# EAGLE design StairLights (EAGLE 9.4.2)
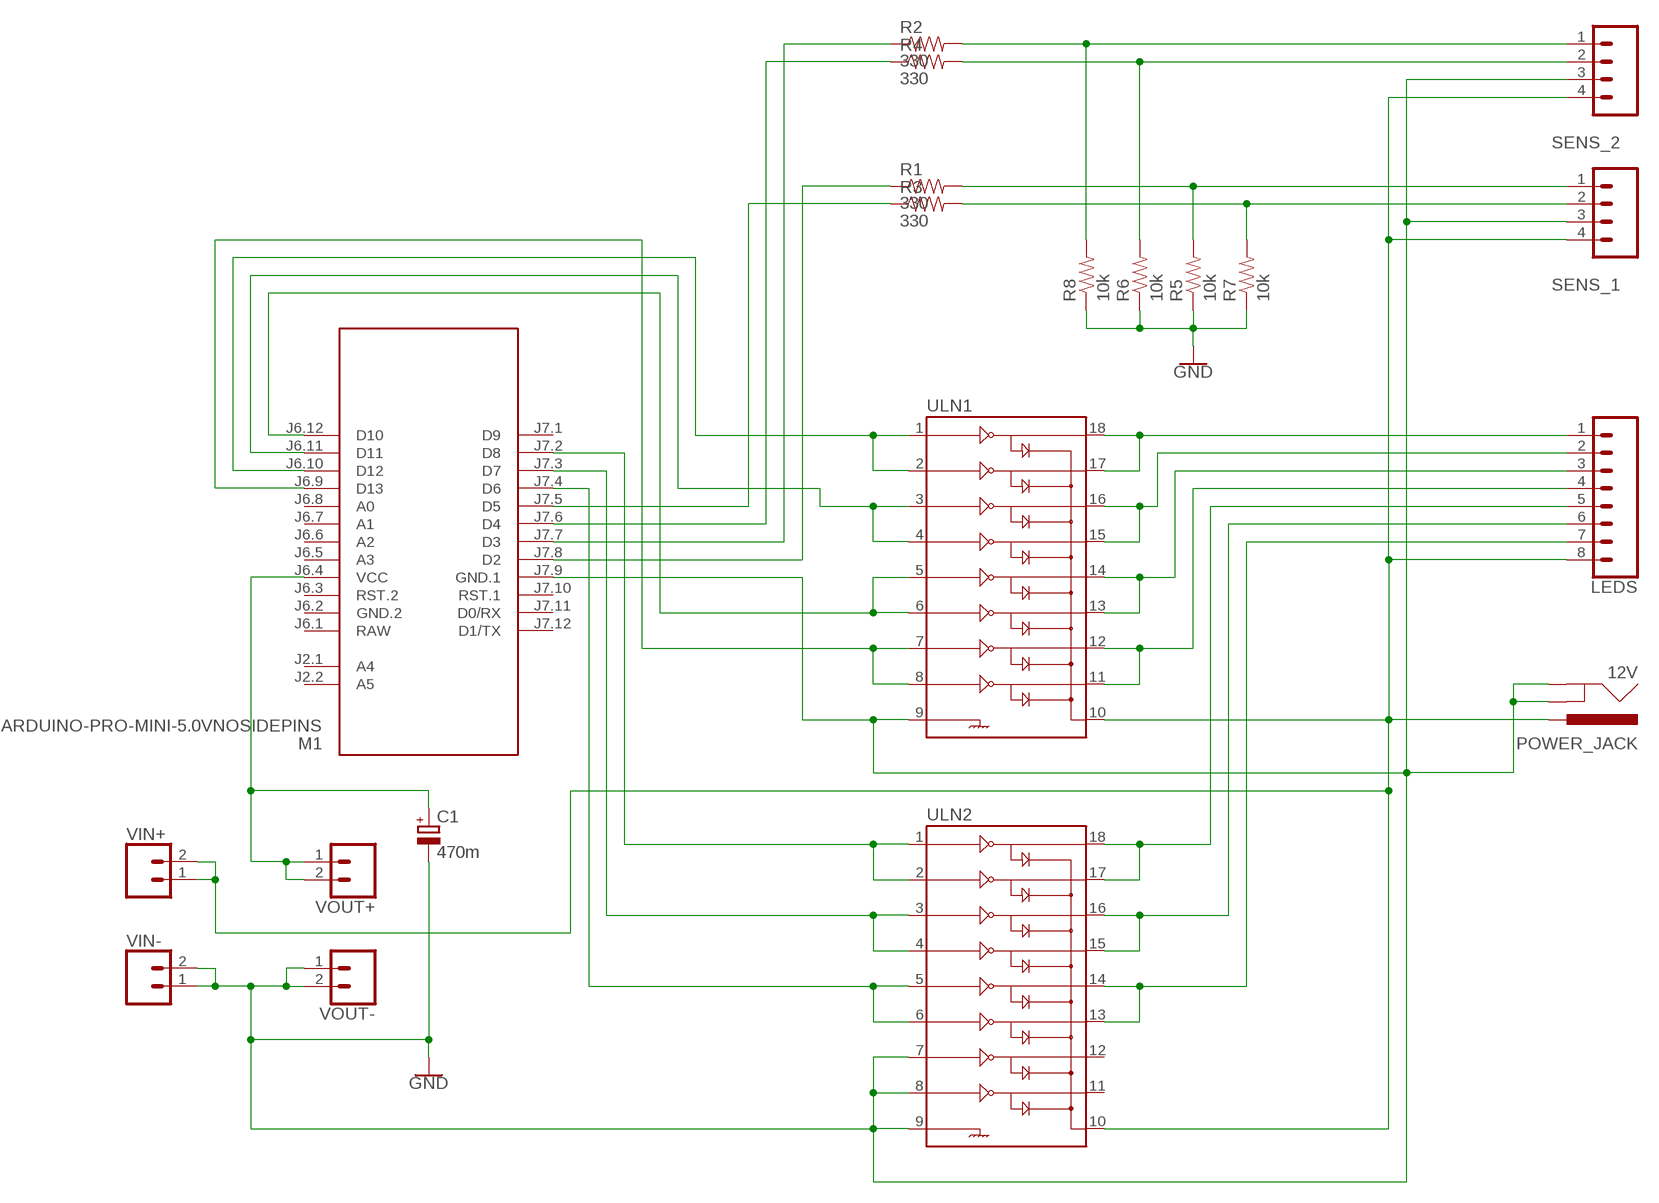
[diagram p0: schematic, sheet 1]

## Parts
12V  POWER_JACK  [POWER_JACK_PTH]
C1  470m  CPOL-EUE5-5  [E5-5]
LEDS  CONN_08LONGPADS  [1X08_LONGPADS]
M1  ARDUINO-PRO-MINI-5.0VNOSIDEPINS  [ARDUINO-PRO-MINI]
R1  330  330OHM-HORIZ-1/10W-5%  [AXIAL-0.3]
R2  330  330OHM-HORIZ-1/10W-5%  [AXIAL-0.3]
R3  330  330OHM-HORIZ-1/10W-5%  [AXIAL-0.3]
R4  330  330OHM-HORIZ-1/10W-5%  [AXIAL-0.3]
R5  10k  330OHM-HORIZ-1/10W-5%  [AXIAL-0.3]
R6  10k  330OHM-HORIZ-1/10W-5%  [AXIAL-0.3]
R7  10k  330OHM-HORIZ-1/10W-5%  [AXIAL-0.3]
R8  10k  330OHM-HORIZ-1/10W-5%  [AXIAL-0.3]
SENS_1  CONN_04LONGPADS  [1X04_LONGPADS]
SENS_2  CONN_04LONGPADS  [1X04_LONGPADS]
ULN1  ULN2803DIP  [DIL18]
ULN2  ULN2803DIP  [DIL18]
VIN+  CONN_02  [1X02]
VIN-  CONN_02  [1X02]
VOUT+  CONN_02  [1X02]
VOUT-  CONN_02  [1X02]

## Nets
GND: 12V.GND 12V.GNDBREAK C1.- M1.J7.9(GND.1) R5.P$1 R6.P$1 R7.P$1 R8.P$1 SENS_1.3 SENS_2.3 ULN1.9 ULN2.7 ULN2.8 ULN2.9 VIN-.1 VIN-.2 VOUT-.1 VOUT-.2
N$1: LEDS.1 ULN1.17 ULN1.18
N$2: LEDS.2 ULN1.15 ULN1.16
N$3: R2.P$2 R8.P$2 SENS_2.1
N$4: LEDS.3 ULN1.13 ULN1.14
N$5: M1.J6.12(D10) ULN1.5 ULN1.6
N$6: LEDS.4 ULN1.11 ULN1.12
N$7: R4.P$2 R6.P$2 SENS_2.2
N$8: LEDS.5 ULN2.17 ULN2.18
N$9: LEDS.6 ULN2.15 ULN2.16
N$10: M1.J6.10(D12) ULN1.1 ULN1.2
N$11: LEDS.7 ULN2.13 ULN2.14
N$12: M1.J7.8(D2) R1.P$1
N$13: M1.J7.3(D7) ULN2.3 ULN2.4
N$14: M1.J7.4(D6) ULN2.5 ULN2.6
N$15: R1.P$2 R5.P$2 SENS_1.1
N$16: 12V.PWR LEDS.8 SENS_1.4 SENS_2.4 ULN1.10 ULN2.10 VIN+.1 VIN+.2
N$17: C1.+ M1.J6.4(VCC) VOUT+.1 VOUT+.2
N$18: M1.J7.7(D3) R2.P$1
N$19: M1.J7.2(D8) ULN2.1 ULN2.2
N$20: M1.J7.6(D4) R4.P$1
N$21: R3.P$2 R7.P$2 SENS_1.2
N$22: M1.J7.5(D5) R3.P$1
N$26: M1.J6.9(D13) ULN1.7 ULN1.8
N$29: M1.J6.11(D11) ULN1.3 ULN1.4
Unconnected: M1.J2.1(A4) M1.J2.2(A5) M1.J6.3(RST.2) M1.J6.5(A3) M1.J6.6(A2) M1.J6.7(A1) M1.J6.8(A0) M1.J7.1(D9) M1.J7.10(RST.1) M1.J7.11(D0/RX) M1.J7.12(D1/TX) ULN2.11 ULN2.12

## Power pins joined to a net without a drawn wire
GND.2: M1.J6.2(GND.2)
RAW: M1.J6.1(RAW)

## Library data of the parts
12V = SparkFun-Connectors:POWER_JACK: Power Jack Connector This is the standard 5.5mm barrel jack for power. The PTH is the most common, proven, reliable, footprint. The Slot footprint only works if the mill layer is transmitted to the PCB fab house so be warned. Here are the connectors we sell at SparkFun: DC Barrel Power Jack/Connector <https://www.sparkfun.com/products/119> (PRT-00119) DC Barrel Power Jack/Connector (SMD) <https://www.sparkfun.com/products/12748> (PRT-12748) DC Barrel Jack Adapter - Breadboard Compatible <https://www.sparkfun.com/products/10811> (PRT-10811) It is used on this SparkFun product (and many, many others): SparkFun RedBoard - Programmed with Arduino <https://www.sparkfun.com/products/12757> (DEV-12757) Also, if you need a mating power supply or connector, please check these out: Wall Adapter Power Supply - 9VDC 650mA <https://www.sparkfun.com/products/298> (TOL-00298) DC Barrel Jack Adapter - Male <https://www.sparkfun.com/products/10287> (PRT-10287); PROD_ID: CONN-08197
C1 = resistor:CPOL-EU: POLARIZED CAPACITOR, European symbol
LEDS = SparkFun-Connectors:CONN_08: Multi connection point. Often used as Generic Header-pin footprint for 0.1 inch spaced/style header connections On any of the 0.1 inch spaced packages, you can populate with these: Break Away Headers - Straight <https://www.sparkfun.com/products/116> (PRT-00116) Break Away Male Headers - Right Angle <https://www.sparkfun.com/products/553> (PRT-00553) Female Headers <https://www.sparkfun.com/products/115> (PRT-00115) Break Away Headers - Machine Pin <https://www.sparkfun.com/products/117> (PRT-00117) Break Away Female Headers - Swiss Machine Pin <https://www.sparkfun.com/products/743> (PRT-00743) Arduino Stackable Header - 8 Pin <https://www.sparkfun.com/products/9279> (PRT-09279) For SCREWTERMINALS and SPRING TERMINALS visit here: Screw Terimnals on SparkFun.com <https://www.sparkfun.com/search/results?term=Screw+Terminals> (5mm/3.5mm/2.54mm spacing) This device is also useful as a general connection point to wire up your design to another part of your project. Our various solder wires solder well into these plated through hole pads. Hook-Up Wire - Assortment (Stranded, 22 AWG) <https://www.sparkfun.com/products/11375> (PRT-11375) Hook-Up Wire - Assortment (Solid Core, 22 AWG) <https://www.sparkfun.com/products/11367> (PRT-11367) View the entire wire category on our website here <https://www.sparkfun.com/categories/141> Special notes: Molex polarized connector foot print use with SKU : PRT-08231 with associated crimp pins and housings. 1MM SMD Version SKU: PRT-10208 NOTES ON THE VARIANTS LOCK and LOCK_LONGPADS... This footprint was designed to help hold the alignment of a through-hole component (i.e. 6-pin header) while soldering it into place. You may notice that each hole has been shifted either up or down by 0.005 of an inch from it's more standard position (which is a perfectly straight line). This slight alteration caused the pins (the squares in the middle) to touch the edges of the holes. Because they are alternating, it causes a "brace" to hold the component in place. 0.005 has proven to be the perfect amount of "off-center" position when using our standard breakaway headers. Although looks a little odd when you look at the bare footprint, once you have a header in there, the alteration is very hard to notice. Also,if you push a header all the way into place, it is covered up entirely on the bottom side.
M1 = diy-modules:ARDUINO-PRO-MINI-*: Arduino Pro Mini and compatible devices More details available here: https://www.arduino.cc/en/Main/ArduinoBoardProMini Click here to find device on ebay.com <http://www.ebay.com/sch/arduino+pro+mini>
R1-R4 = SparkFun-Resistors:330OHM: 330Ω resistor A resistor is a passive two-terminal electrical component that implements electrical resistance as a circuit element. Resistors act to reduce current flow, and, at the same time, act to lower voltage levels within circuits. - Wikipedia; PROD_ID: RES-8371
R5-R8 = SparkFun-Resistors:330OHM: 330Ω resistor A resistor is a passive two-terminal electrical component that implements electrical resistance as a circuit element. Resistors act to reduce current flow, and, at the same time, act to lower voltage levels within circuits. - Wikipedia; PROD_ID: RES-8371; VALUE: 330
SENS_1 SENS_2 = SparkFun-Connectors:CONN_04: Multi connection point. Often used as Generic Header-pin footprint for 0.1 inch spaced/style header connections On any of the 0.1 inch spaced packages, you can populate with these: Break Away Headers - Straight <https://www.sparkfun.com/products/116> (PRT-00116) Break Away Male Headers - Right Angle <https://www.sparkfun.com/products/553> (PRT-00553) Female Headers <https://www.sparkfun.com/products/115> (PRT-00115) Break Away Headers - Machine Pin <https://www.sparkfun.com/products/117> (PRT-00117) Break Away Female Headers - Swiss Machine Pin <https://www.sparkfun.com/products/743> (PRT-00743) For SCREWTERMINALS and SPRING TERMINALS visit here: Screw Terimnals on SparkFun.com <https://www.sparkfun.com/search/results?term=Screw+Terminals> (5mm/3.5mm/2.54mm spacing) This device is also useful as a general connection point to wire up your design to another part of your project. Our various solder wires solder well into these plated through hole pads. Hook-Up Wire - Assortment (Stranded, 22 AWG) <https://www.sparkfun.com/products/11375> (PRT-11375) Hook-Up Wire - Assortment (Solid Core, 22 AWG) <https://www.sparkfun.com/products/11367> (PRT-11367) View the entire wire category on our website here <https://www.sparkfun.com/categories/141> Special notes: Molex polarized connector foot print use with SKU : PRT-08231 with associated crimp pins and housings. 1MM SMD Version SKU: PRT-10208; PROD_ID: CONN-09696
ULN1 ULN2 = SparkFun-IC-Special-Function:ULN2803: Darlington Driver(IC-07959, low stock) ULN2803 Darlington array. 500mA max per channel, 8-channel package. Spark Fun Electronics SKU : COM-00312
VIN+ VIN- VOUT+ VOUT- = SparkFun-Connectors:CONN_02: Multi connection point. Often used as Generic Header-pin footprint for 0.1 inch spaced/style header connections On any of the 0.1 inch spaced packages, you can populate with these: Break Away Headers - Straight <https://www.sparkfun.com/products/116> (PRT-00116) Break Away Male Headers - Right Angle <https://www.sparkfun.com/products/553> (PRT-00553) Female Headers <https://www.sparkfun.com/products/115> (PRT-00115) Break Away Headers - Machine Pin <https://www.sparkfun.com/products/117> (PRT-00117) Break Away Female Headers - Swiss Machine Pin <https://www.sparkfun.com/products/743> (PRT-00743) For SCREWTERMINALS and SPRING TERMINALS visit here: Screw Terimnals on SparkFun.com <https://www.sparkfun.com/search/results?term=Screw+Terminals> (5mm/3.5mm/2.54mm spacing) This device is also useful as a general connection point to wire up your design to another part of your project. Our various solder wires solder well into these plated through hole pads. Hook-Up Wire - Assortment (Stranded, 22 AWG) <https://www.sparkfun.com/products/11375> (PRT-11375) Hook-Up Wire - Assortment (Solid Core, 22 AWG) <https://www.sparkfun.com/products/11367> (PRT-11367) View the entire wire category on our website here <https://www.sparkfun.com/categories/141> Special notes: Molex polarized connector foot print use with: PRT-08233 with associated crimp pins and housings. 2.54_SCREWTERM for use with PRT-10571. 3.5mm Screw Terminal footprints for PRT-08084 5mm Screw Terminal footprints for use with PRT-08432

## Board
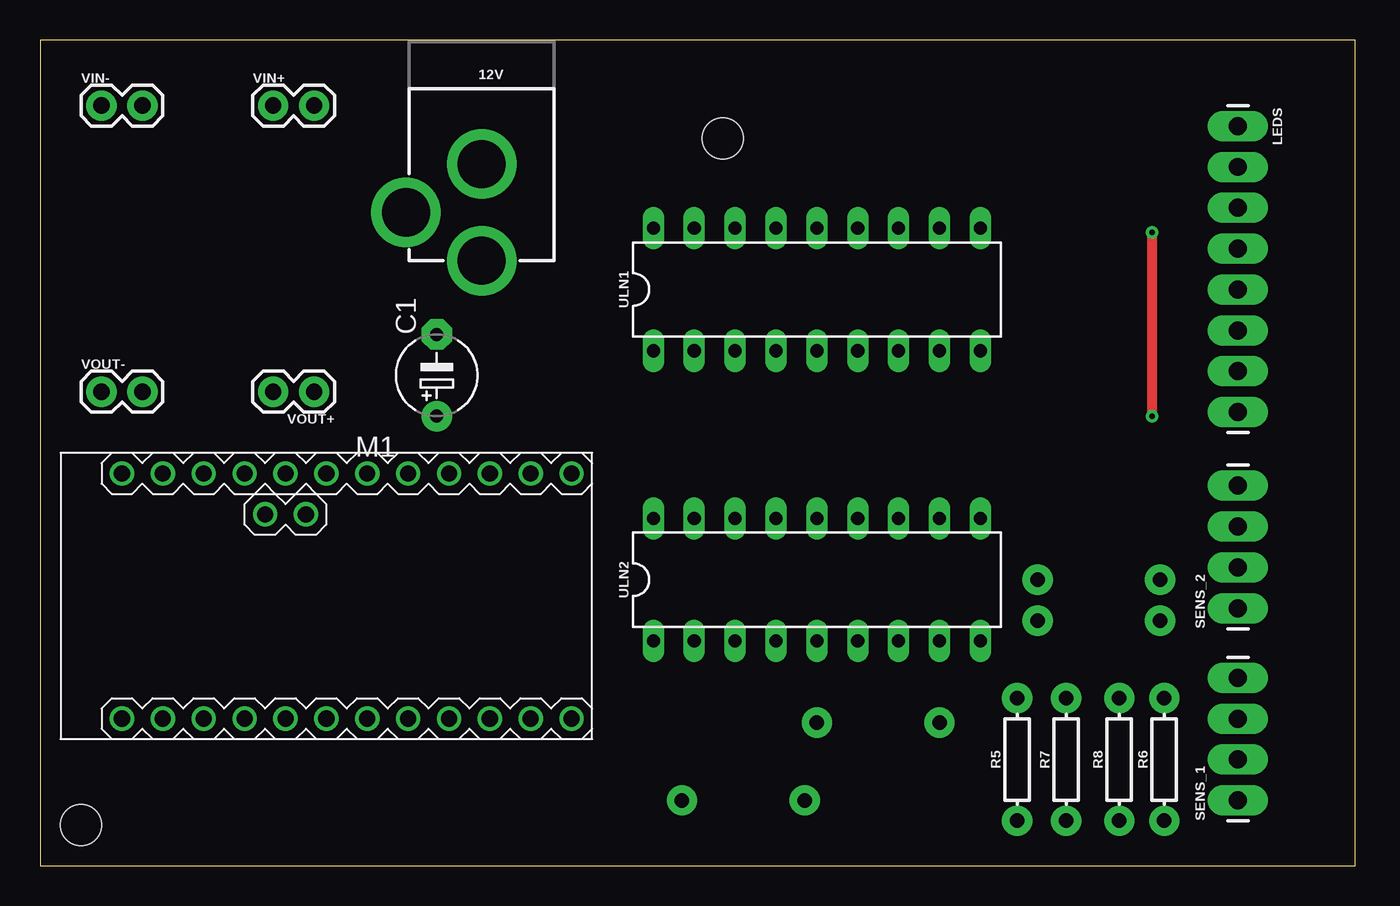
[diagram p1: board, top side]
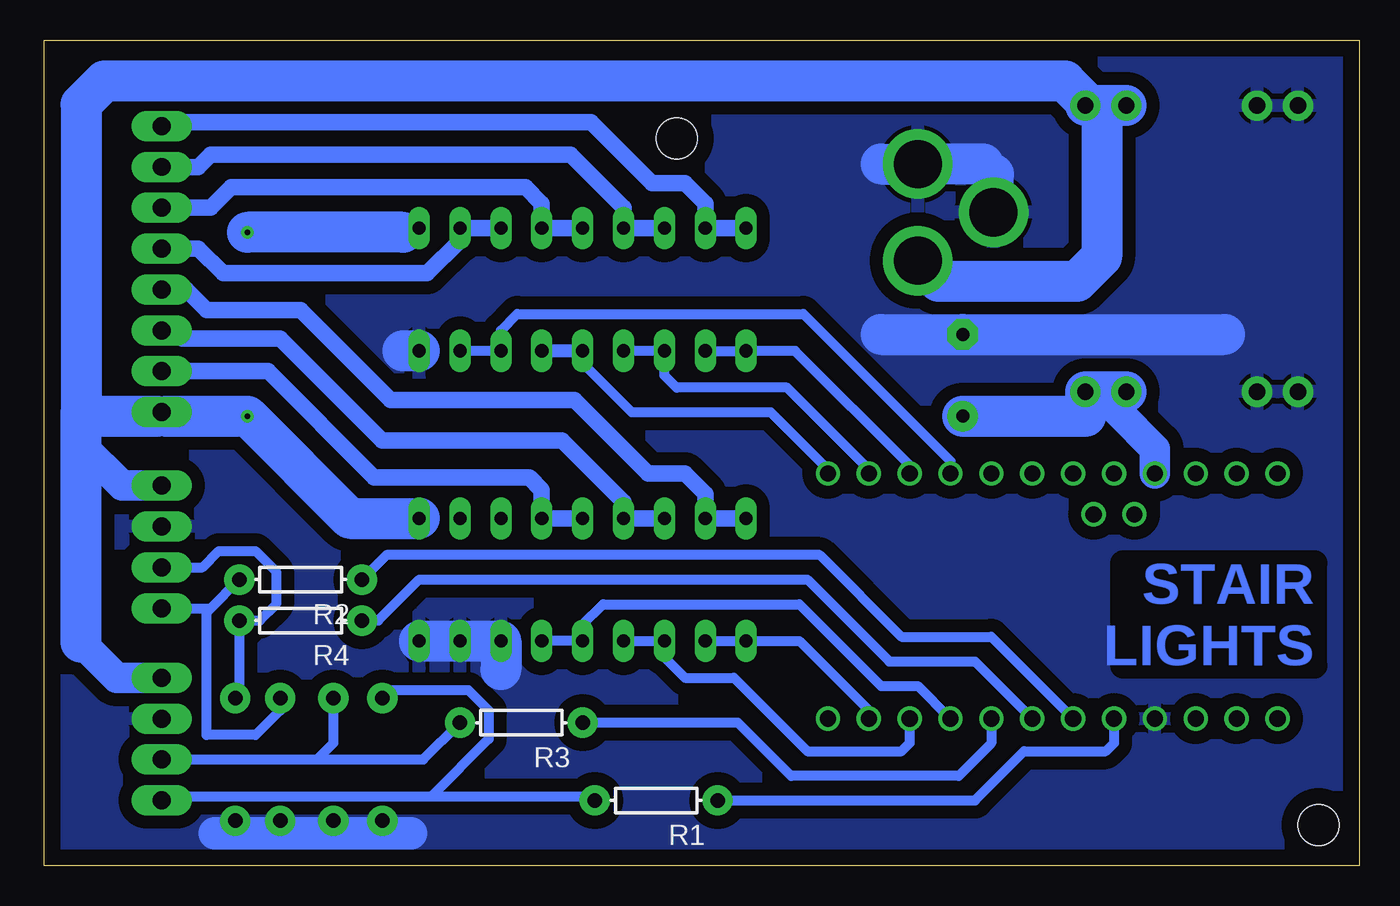
[diagram p2: board, bottom side, seen from below]

Size 81.71 x 51.3 mm. Coordinates in mm from the lower left corner, seen from the top.
Outline: 0,0 81.71,0 81.71,51.3 0,51.3 0,0
Copper layers (1*16): Top 0.035mm / dielectric 1.5mm / Bottom 0.035mm
Design rules "default": minimum track width 6mil, minimum drill 0.35mm, track to track 6mil, track to pad 6mil, pad to pad 6mil, via to via 6mil, smd to smd 6mil, copper to edge 40mil, drill to drill 6mil, minimum pad ring 10mil, minimum via ring 8mil, stop-mask expansion 4mil, vias tented up to drill 0mil, thermal gap 10mil
Holes 2.54 mm at 2.54,2.54 86.11,3.3 42.42,45.21

### Footprints (pad centres in the part's own frame; a part is rotated, then mirrored left to right if it is on the bottom)
POWER_JACK_PTH = drill 2.997 pad 4.318: GND 0,7.7; GNDBREAK 4.7,10.7; PWR 0,13.7
E5-5 = drill 0.813 pad 1.905: + -2.54,0 | drill 0.813 pad 1.905 octagon: - 2.54,0
1X08_LONGPADS = drill 1.118 pad 1.88 long: 1 0,0; 2 2.54,0; 3 5.08,0; 4 7.62,0; 5 10.16,0; 6 12.7,0; 7 15.24,0; 8 17.78,0
ARDUINO-PRO-MINI = drill 1: J2.1 -1.27,5.08; J2.2 -3.81,5.08; J6.1 -12.7,7.62; J6.2 -10.16,7.62; J6.3 -7.62,7.62; J6.4 -5.08,7.62; J6.5 -2.54,7.62; J6.6 0,7.62; J6.7 2.54,7.62; J6.8 5.08,7.62; J6.9 7.62,7.62; J6.10 10.16,7.62; J6.11 12.7,7.62; J6.12 15.24,7.62; J7.1 15.24,-7.62; J7.2 12.7,-7.62; J7.3 10.16,-7.62; J7.4 7.62,-7.62; J7.5 5.08,-7.62; J7.6 2.54,-7.62; J7.7 0,-7.62; J7.8 -2.54,-7.62; J7.9 -5.08,-7.62; J7.10 -7.62,-7.62; J7.11 -10.16,-7.62; J7.12 -12.7,-7.62
AXIAL-0.3 = drill 0.9 pad 1.88: P$1 -3.81,0; P$2 3.81,0
1X04_LONGPADS = drill 1.118 pad 1.88 long: 1 0,0; 2 2.54,0; 3 5.08,0; 4 7.62,0
DIL18 = drill 0.813 long: 1 -10.16,-3.81; 2 -7.62,-3.81; 3 -5.08,-3.81; 4 -2.54,-3.81; 5 0,-3.81; 6 2.54,-3.81; 7 5.08,-3.81; 8 7.62,-3.81; 9 10.16,-3.81; 10 10.16,3.81; 11 7.62,3.81; 12 5.08,3.81; 13 2.54,3.81; 14 0,3.81; 15 -2.54,3.81; 16 -5.08,3.81; 17 -7.62,3.81; 18 -10.16,3.81
1X02 = drill 1.016 pad 1.88: 1 0,0; 2 2.54,0

### Placement (x,y rotation side)
12V  27.43,51.31 180 top
C1  24.64,30.48 90 top
LEDS  74.42,45.97 270 top
M1  17.78,16.76 0 top
R1  43.69,4.06 180 bottom
R2  65.79,17.78 180 bottom
R3  52.07,8.89 180 bottom
R4  65.79,15.24 180 bottom
R5  60.71,6.6 90 top
R6  69.85,6.6 90 top
R7  63.75,6.6 90 top
R8  67.06,6.6 90 top
SENS_1  74.42,4.06 90 top
SENS_2  74.42,16 90 top
ULN1  48.26,35.81 0 top
ULN2  48.26,17.78 0 top
VIN+  14.48,47.24 0 top
VIN-  3.81,47.24 0 top
VOUT+  17.02,29.46 180 top
VOUT-  3.81,29.46 0 top

### Tracks (layer width: path | path; a pad name or v marks a point on that pad's centre or on a via)
GND
  Bottom 2.032: 58.93,2.03 71.12,2.03
  Bottom 2.54: 23.37,43.61 12V.GND 29.72,43.61 | 12V.GNDBREAK 22.73,42.97 | 8.38,33.02 C1.- 29.72,33.02 | ULN2.9 ULN2.7 53.34,12.19 | ULN1.9 59.44,32
  pour Bottom (isolate 0.813): -0.25,51.56 82.04,51.56 82.04,-0.25 0,-0.25 -0.25,-0.51
N$1
  Bottom 1.016: ULN1.18 ULN1.17 40.64,41.15 41.91,42.42 43.94,42.42 47.75,46.23 74.17,46.23 LEDS.1
N$2
  Bottom 1.016: ULN1.16 ULN1.15 45.72,40.89 49.02,44.2 71.37,44.2 72.14,43.43 LEDS.2
N$3
  Bottom 0.61: SENS_2.1 71.37,16 | 71.37,16 R2.P$2 | R8.P$2 67.06,9.65 68.58,8.13 71.63,8.13 71.63,15.75 71.37,16
N$4
  Bottom 1.016: ULN1.14 ULN1.13 50.8,41.15 51.82,42.16 70.1,42.16 71.37,40.89 LEDS.3
N$5
  Bottom 0.61: ULN1.5 48.26,31.24 45.21,28.19 36.58,28.19 33.02,24.64 M1.J6.12
  Bottom 0.813: ULN1.5 ULN1.6
N$6
  Bottom 1.016: ULN1.12 ULN1.11 55.88,38.86 57.91,36.83 70.61,36.83 72.14,38.35 LEDS.4
N$7
  Bottom 0.61: SENS_2.2 71.88,18.54 70.87,19.56 68.58,19.56 67.31,18.29 67.31,16.26 68.33,15.24 R4.P$2 69.6,10.67 R6.P$2
N$8
  Bottom 1.016: ULN2.18 ULN2.17 40.64,23.11 41.91,24.38 44.2,24.38 48.77,28.96 60.2,28.96 65.79,34.54 71.63,34.54 72.9,35.81 LEDS.5
N$9
  Bottom 1.016: ULN2.16 ULN2.15 45.72,22.61 49.53,26.42 60.71,26.42 67.06,32.77 73.15,32.77 73.66,33.27 LEDS.6
N$10
  Bottom 0.61: ULN1.2 ULN1.1 35.05,32 27.94,24.89 M1.J6.10
N$11
  Bottom 1.016: ULN2.14 ULN2.13 50.8,23.37 51.56,24.13 61.21,24.13 67.82,30.73 LEDS.7
N$12
  Bottom 0.61: M1.J7.8 15.24,7.62 15.75,7.11 20.83,7.11 23.88,4.06 R1.P$1
N$13
  Bottom 0.61: ULN2.4 ULN2.3 43.18,12.95 41.91,11.68 38.86,11.68 34.29,7.11 28.45,7.11 27.94,7.62 M1.J7.3
N$14
  Bottom 0.61: ULN2.6 ULN2.5 48.26,14.99 46.99,16.26 34.8,16.26 29.72,11.18 27.43,11.18 M1.J7.4
N$15
  Bottom 0.61: SENS_1.1 74.17,4.32 57.66,4.32 | 57.66,4.32 47.75,4.32 R1.P$2 | R5.P$2 60.2,10.92 55.37,10.92 54.1,9.65 54.1,7.87 57.66,4.32
N$16  (via drill 0.35)
  Top 0.61: v69.09,39.37 v69.09,27.94
  Bottom 0.61: 79.43,28.41 79.43,27.94
  Bottom 1.27: 59.44,39.37 58.67,39.37 ULN1.10
  Bottom 1.905: 16,46.23 VIN+.2 | 69.34,27.94 69.09,28.19 v69.09,27.94 | 74.17,27.94 LEDS.8 74.68,27.94 | 79.43,28.19 79.43,28.41 | 79.43,13.89 77.22,11.68 SENS_1.4 | SENS_2.4 76.89,23.62 79.43,26.16
  Bottom 2.54: ULN2.10 62.74,21.59 v69.09,27.94 | 59.44,39.37 v69.09,39.37 | VIN+.1 VIN+.2 17.02,47.5 18.29,48.77 77.98,48.77 79.43,47.32 79.43,28.19 | 12V.PWR 26.15,36.32 17.53,36.32 16,37.85 16,46.23 | 74.17,27.94 69.34,27.94 | 74.68,27.94 79.43,27.94 79.43,26.16 79.43,13.89
N$17
  Bottom 1.905: M1.J6.4 12.7,25.91 14.99,28.19 14.99,28.96 VOUT+.2
  Bottom 2.54: VOUT+.2 VOUT+.1 17.02,27.94 C1.+
N$18
  Bottom 0.61: M1.J7.7 22.86,14.22 28.45,14.22 33.53,19.3 60.45,19.3 R2.P$1
N$19
  Bottom 0.61: ULN2.2 ULN2.1 34.8,13.97 30.48,9.65 M1.J7.2
N$20
  Bottom 0.61: M1.J7.6 23.88,12.7 29.21,12.7 34.29,17.78 58.42,17.78 60.96,15.24 R4.P$1
N$21
  Bottom 0.61: SENS_1.2 64.77,6.6 | 64.77,6.6 58.17,6.6 R3.P$2 | R7.P$2 63.75,7.62 64.77,6.6
N$22
  Bottom 0.61: M1.J7.5 22.86,7.62 24.89,5.59 35.31,5.59 38.61,8.89 R3.P$1
N$26
  Bottom 0.61: ULN1.8 ULN1.7 53.34,33.27 52.32,34.29 34.54,34.29 25.4,25.15 M1.J6.9
N$29
  Bottom 0.61: ULN1.4 ULN1.3 43.18,30.48 42.42,29.72 35.56,29.72 30.48,24.64 M1.J6.11

### Text on the board
Bottom: STAIR / LIGHTS